# EAGLE design V-00757-01 (EAGLE 7.2.0)
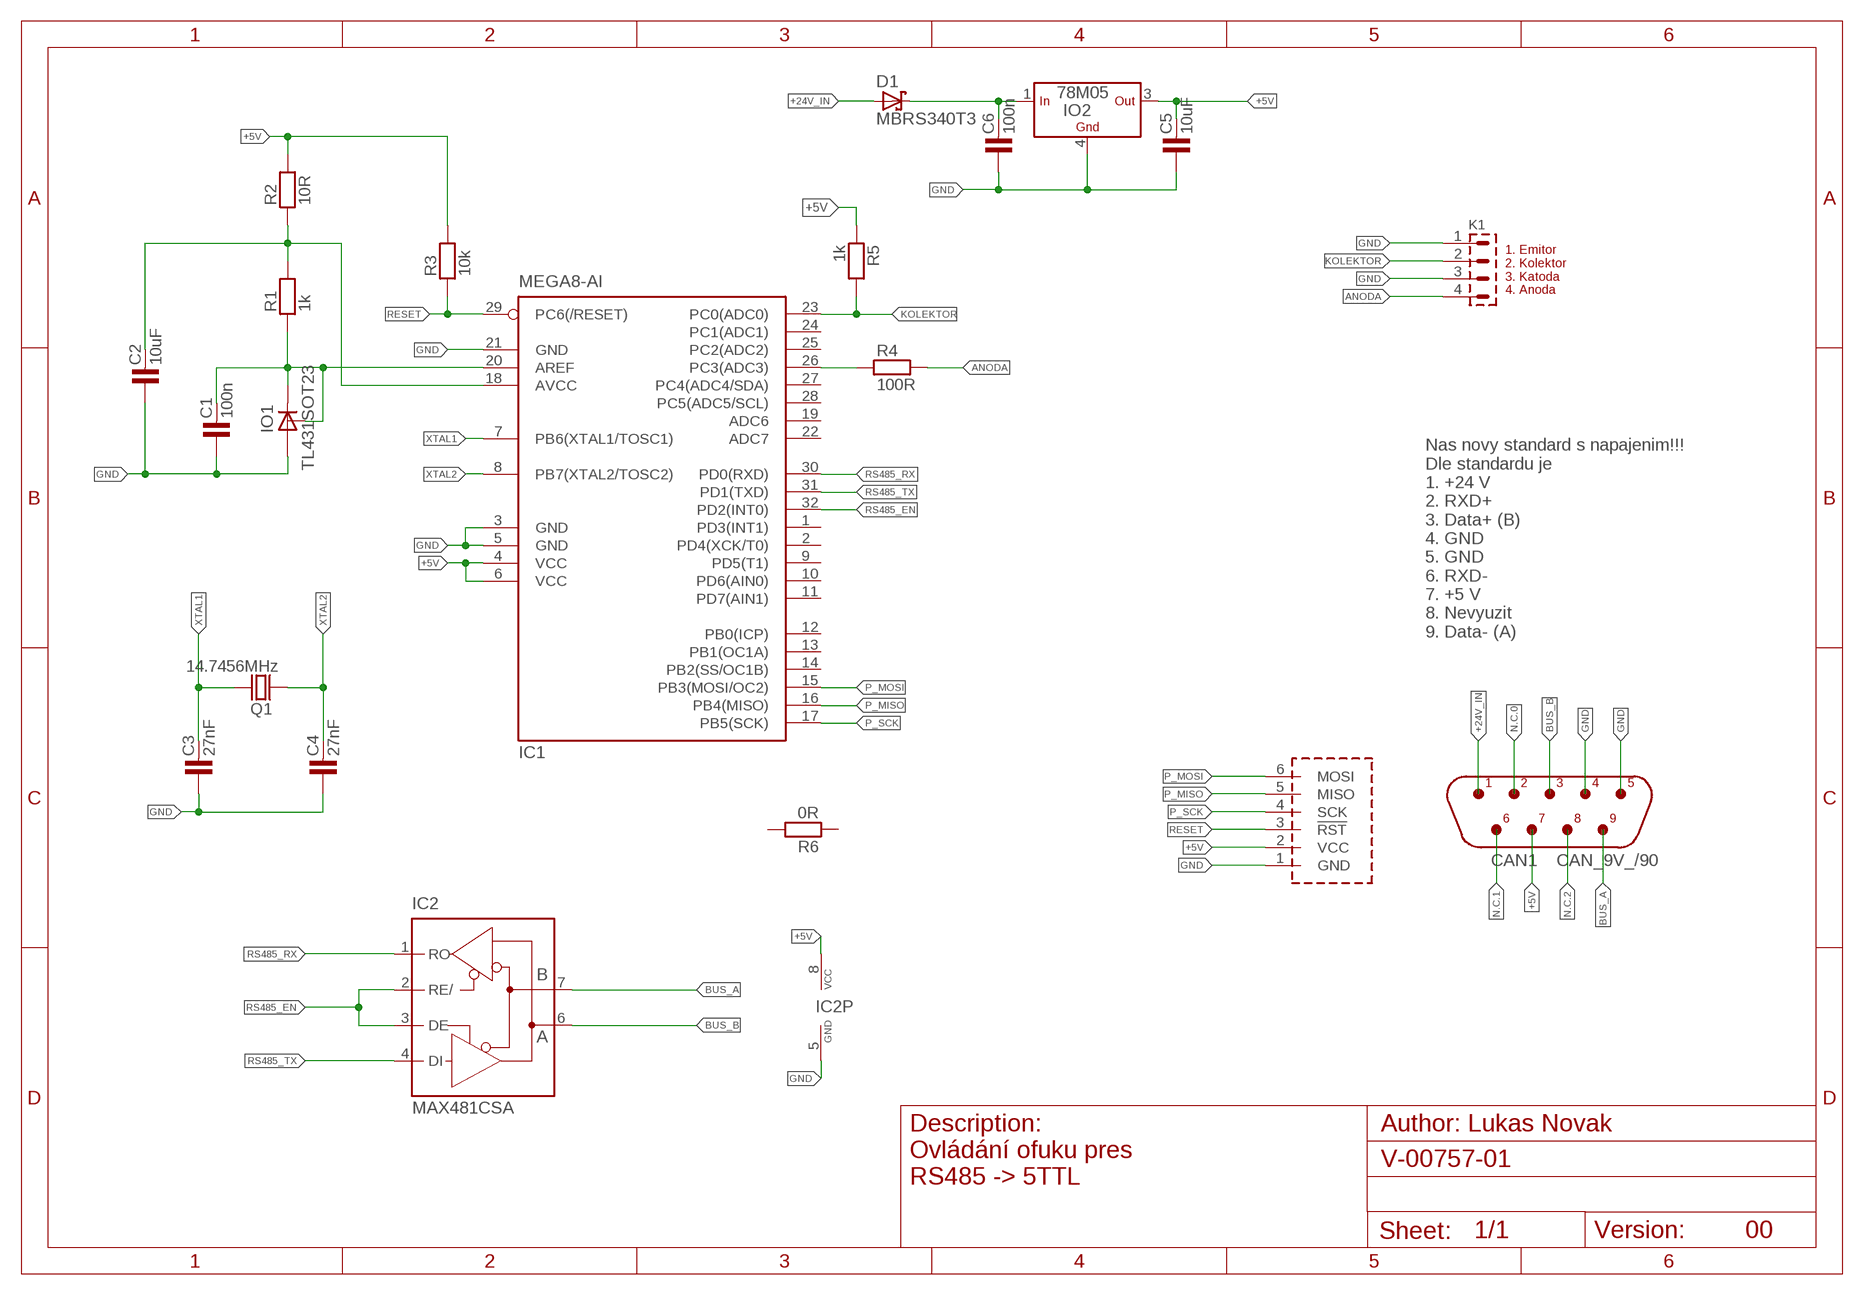
[diagram p0: schematic, sheet 1]

## Parts
C1  100n  C-KER_1206  [1206]
C2  10uF  C-KER_1206  [1206]
C3  27nF  C-KER_0805  [0805]
C4  27nF  C-KER_0805  [0805]
C5  10uF  C-KER_1206  [1206]
C6  100n  C-KER_1206  [1206]
CAN1  CAN_9V_/90  [CAN9V/90]
D1  MBRS340T3  [SMC]
IC1  MEGA8-AI  [TQFP32-08]
IC2  MAX481CSA  [SO08]
IO1  TL431SOT23  [SOT23]
IO2  78M05  78M  [DPAK]
K1  PSH02-04W  [PSH02-04W]
Q1  14.7456MHz  Q_HC-49U  [HC-49U]
R1  1k  R_1206  [1206]
R2  10R  R_1206  [1206]
R3  10k  R_1206  [1206]
R4  100R  R_1206  [1206]
R5  1k  R_1206  [1206]
R6  0R  R_1206  [1206]
U$1  AVR_PROG_SPI  [PSH02-06P]

## Nets
+5V: C5.2 CAN1.7 IC1.4(VCC) IC1.6(VCC) IC2.8(VCC) IO2.3(OUT) R2.2 R3.2 R5.1 U$1.2(VCC)
+24V: C6.2 D1.C IO2.1(IN)
+24V_IN: CAN1.1 D1.A
ANODA: K1.4 R4.2
BUS_A: CAN1.9 IC2.7(B)
BUS_B: CAN1.3 IC2.6(A)
GND: C1.1 C2.1 C3.1 C4.1 C5.1 C6.1 CAN1.4 CAN1.5 IC1.3(GND) IC1.5(GND) IC1.21(GND) IC2.5(GND) IO1.3(A) IO2.4(GND) K1.1 K1.3 U$1.1(GND)
KOLEKTOR: IC1.23(PC0(ADC0)) K1.2 R5.2
N$1: C1.2 IC1.20(AREF) IO1.1(C) IO1.2(R) R1.1
N$3: IC1.26(PC3(ADC3)) R4.1
N$6: C2.2 IC1.18(AVCC) R1.2 R2.1
N.C.0: CAN1.2
N.C.1: CAN1.6
N.C.2: CAN1.8
P_MISO: IC1.16(PB4(MISO)) U$1.5(MISO)
P_MOSI: IC1.15(PB3(MOSI/OC2)) U$1.6(MOSI)
P_SCK: IC1.17(PB5(SCK)) U$1.4(SCK)
RESET: IC1.29(PC6(/RESET)) R3.1 U$1.3(!RST)
RS485_EN: IC1.32(PD2(INT0)) IC2.2(RE/) IC2.3(DE)
RS485_RX: IC1.30(PD0(RXD)) IC2.1(RO)
RS485_TX: IC1.31(PD1(TXD)) IC2.4(DI)
XTAL1: C3.2 IC1.7(PB6(XTAL1/TOSC1)) Q1.2
XTAL2: C4.2 IC1.8(PB7(XTAL2/TOSC2)) Q1.1
Unconnected: IC1.1(PD3(INT1)) IC1.2(PD4(XCK/T0)) IC1.9(PD5(T1)) IC1.10(PD6(AIN0)) IC1.11(PD7(AIN1)) IC1.12(PB0(ICP)) IC1.13(PB1(OC1A)) IC1.14(PB2(SS/OC1B)) IC1.19(ADC6) IC1.22(ADC7) IC1.24(PC1(ADC1)) IC1.25(PC2(ADC2)) IC1.27(PC4(ADC4/SDA)) IC1.28(PC5(ADC5/SCL)) R6.1 R6.2

## Notes on the sheet
- 1. Emitor
  2. Kolektor
  3. Katoda
  4. Anoda
- Nas novy standard s napajenim!!!
  Dle standardu je
  1. +24 V
  2. RXD+
  3. Data+ (B)
  4. GND
  5. GND
  6. RXD-
  7. +5 V
  8. Nevyuzit
  9. Data- (A)
- Ovládání ofuku pres
  RS485 -> 5TTL
- 00

## Library data of the parts
C1-C6 = #PaJa_31:C-KER: Kondenzator - keramicky
CAN1 = #PaJa_konektory:CAN_9V: Konektory CANNON - vidlice - 9pinu
D1 = diode:MBRS3*0T3: SCHOTTKY BARRIER RECTIFIER 3.0 AMPERES 20, 30, 40 VOLT Source: MBRS340T3-D.pdf
IC1 = atmel:MEGA8: MICROCONTROLLER 8 Kbytes FLASH, 1 kbytes SRAM, 512 bytes EEPROM, USART, 6-channel 10 bit ADC, 2-channel 8 bit ADC Pin compatible with Atmega48, ATMega88, ATMega168 Source: avr.lbr; MPN: ATMEGA8-16AU; OC_FARNELL: 9171371; OC_NEWARK: 73M8863
IC2 = maxim:MAX481CSA: RS485 TRANSEIVER; MF: MAXIM; MPN: MAX481CSA; OC_FARNELL: unknown; OC_NEWARK: 90C3817
IO1 = references:TL431: Programmable Shunt Regulator TL431 Features > Programmable Output Voltage to 36 Volts > Low Dynamic Output Impedance 0.2? Typical > Sink Current Capability of 1.0 to 100mA > Equivalent Full-Range Temperature Coefficient of 50ppm/°C Typical > Temperature Compensated For Operation Over Full Rated Operating Temperature Range > Low Output Noise Voltage > Fast Turn-on Response; MPN: TL431BFDT; OC_FARNELL: 2095471; PACKAGE: SOT23; SUPPLIER: NXP
IO2 = #PaJa_31:78?: Stabilizator - 1A a 1,5A ? - napeti => 05, 06, 08, 09, 12, 15, 18, 20, 24 => 1,5A ? - napeti => 10, 12, 15, 18 => 1A S ? - napeti => 05, 09, 10, 12, 15, 18, 24 => 2A T ? - napeti => 05 => 3A ------------------------------------------------------- Stabilizator - 100mA (TO-92 , SOT-89) ? - napeti => 02, 05, 06, 08, 09, 12, 15, 18
K1 = #PaJa_konektory:PSH02-04: Konektory se zamkem - vidlice - 4pin
Q1 = #PaJa_31:Q: Krystal HC-49 - 1MHz - 48MHz DT38 - Quartz (hodinovy) 32,768kHz
R1-R6 = #PaJa_31:R: Rezistor
U$1 = #PaJa_konektory:AVR_PROG_SPI

## Board
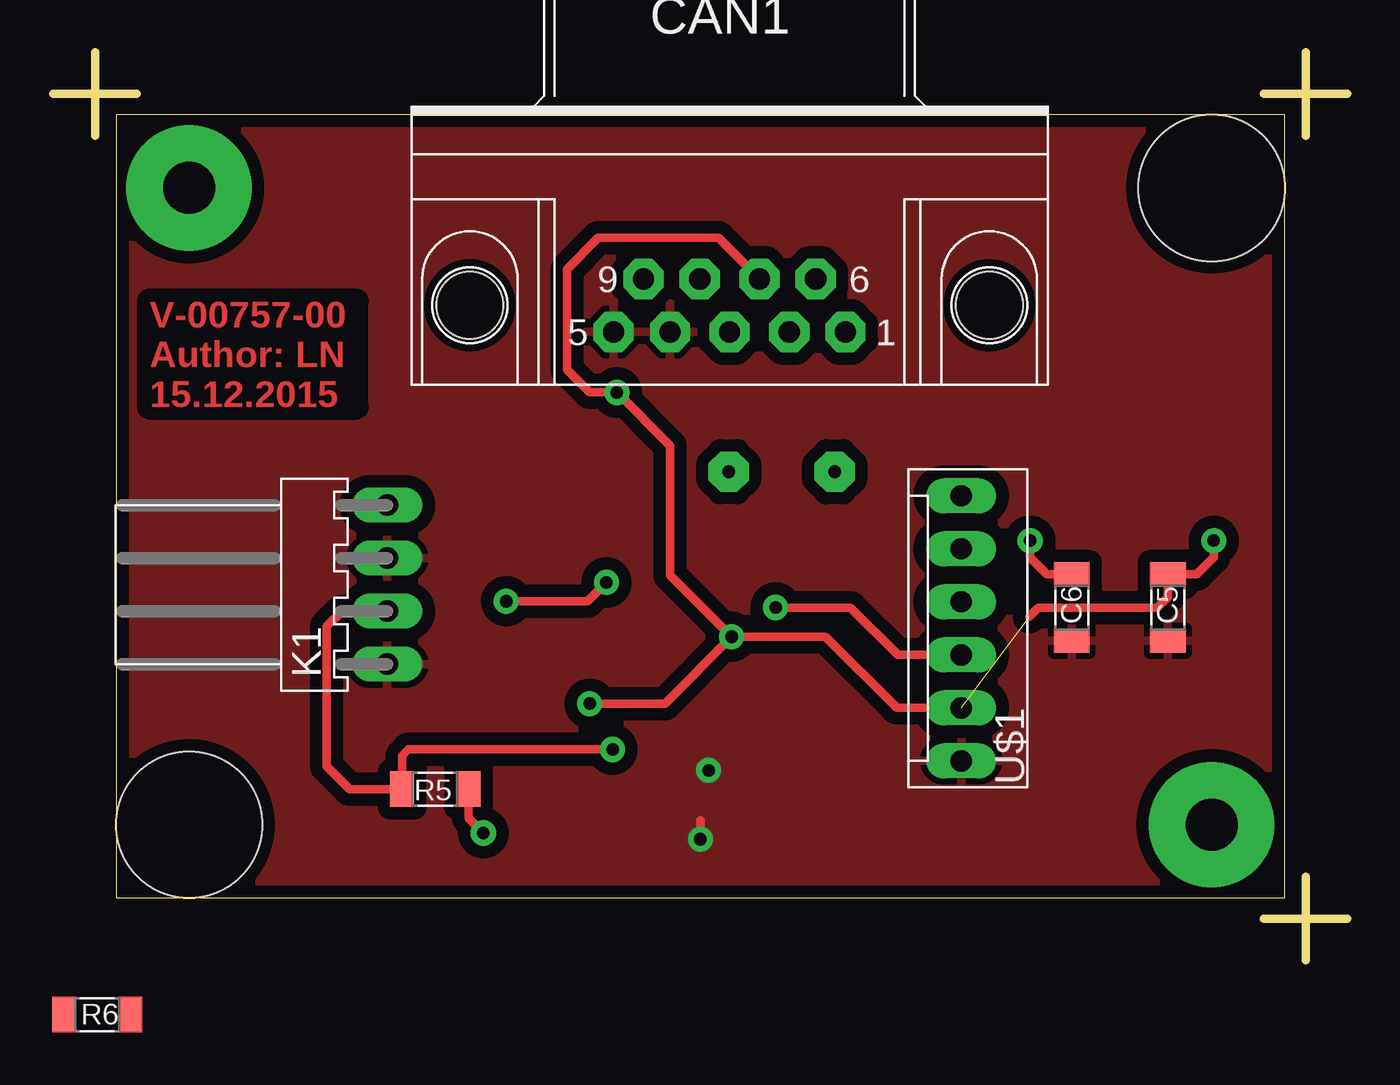
[diagram p1: board, top side]
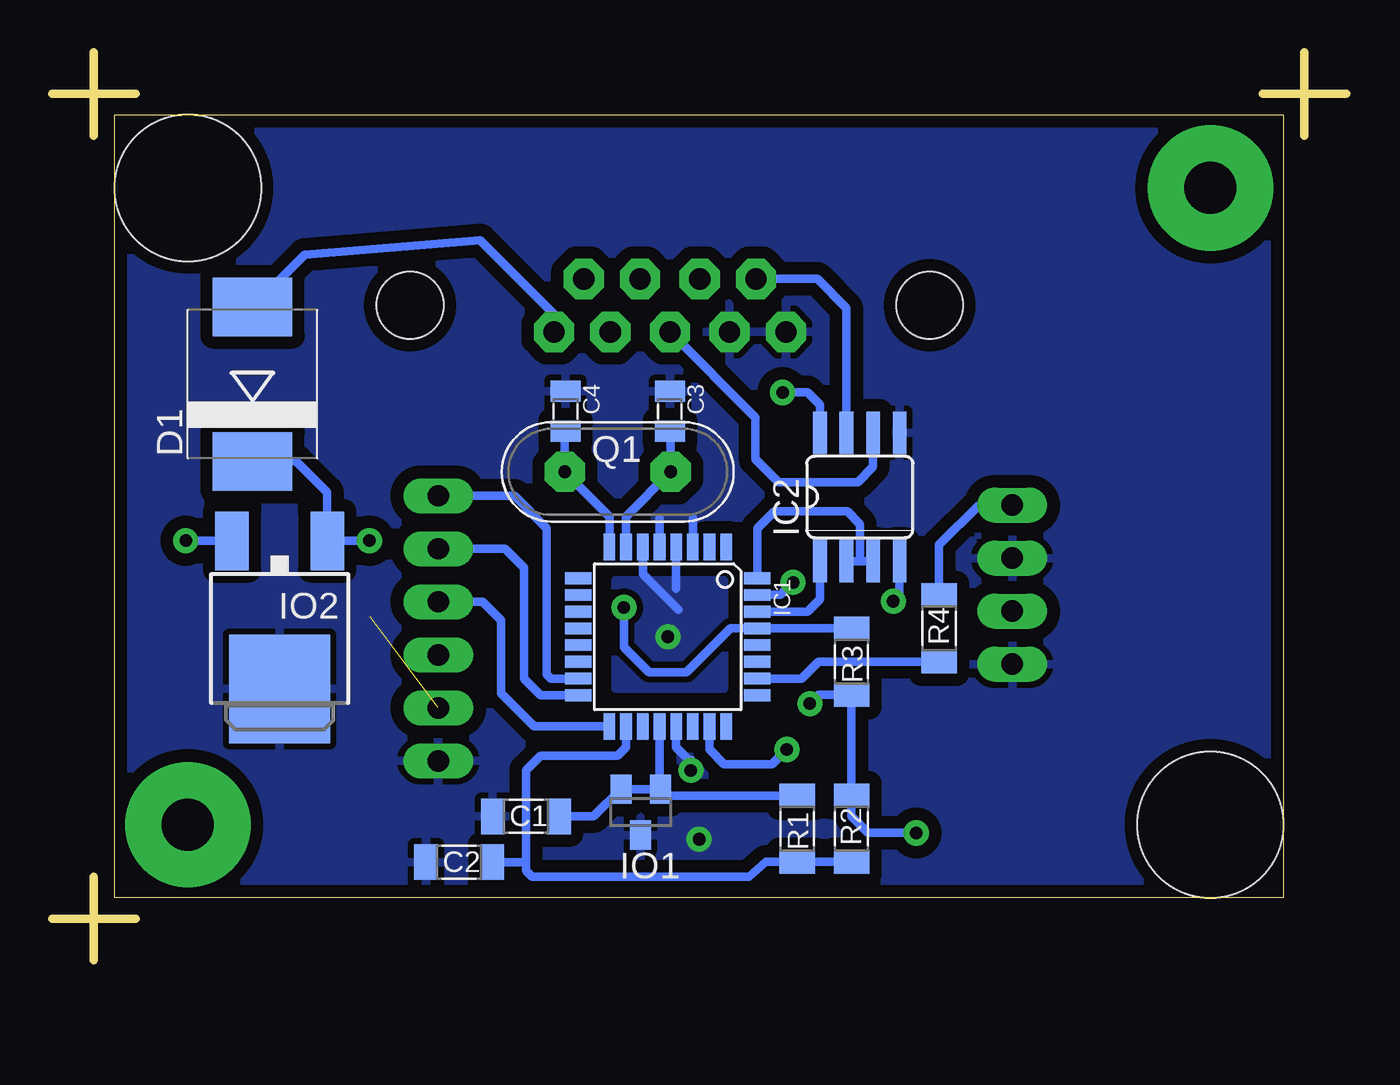
[diagram p2: board, bottom side, seen from below]

Size 62 x 43.5 mm. Coordinates in mm from the lower left corner, seen from the top.
Outline: 0,41.5 4,41.5
Outline: 2,39.5 2,43.5
Outline: 58,41.5 62,41.5
Outline: 60,39.5 60,43.5
Outline: 58,2 62,2
Outline: 60,0 60,4
Outline: 3,3 59,3 59,40.5 3,40.5 3,3
Copper layers (1*16): Top 0.04mm / dielectric 1.5mm / Bottom 0.04mm
Design rules "mucha_navrh *": minimum track width 0.2mm, minimum drill 0.6mm, track to track 0.3mm, track to pad 0.3mm, pad to pad 0.3mm, via to via 0.3mm, smd to smd 0mil, copper to edge 0.6mm, drill to drill 0.5mm, minimum pad ring 0.3mm, minimum via ring 0.3mm, stop-mask expansion 0.1mm, vias tented up to drill 0.8mm, thermal gap 0.3mm
Holes 7 mm at 6.5,6.5 55.5,37

### Footprints (pad centres in the part's own frame; a part is rotated, then mirrored left to right if it is on the bottom)
1206 = smd 1.143 x 1.702: 1 -1.587,0; 2 1.587,0
0805 = smd 1.016 x 1.422: 1 -0.953,0; 2 0.953,0
CAN9V/90 = drill 1.016 pad 1.93 octagon: 1 5.556,0; 2 2.857,0; 3 0,0; 4 -2.857,0; 5 -5.556,0; 6 4.128,2.54; 7 1.429,2.54; 8 -1.429,2.54; 9 -4.128,2.54 | hole 3.2: 12.446,1.27; -12.446,1.27
SMC = smd 2.8 x 3.8: A 3.7,0; C -3.7,0
TQFP32-08 = smd 1.27 x 0.559: 1 -4.293,2.8; 2 -4.293,2; 3 -4.293,1.2; 4 -4.293,0.4; 5 -4.293,-0.4; 6 -4.293,-1.2; 7 -4.293,-2; 8 -4.293,-2.8; 17 4.293,-2.8; 18 4.293,-2; 19 4.293,-1.2; 20 4.293,-0.4; 21 4.293,0.4; 22 4.293,1.2; 23 4.293,2; 24 4.293,2.8 | smd 0.559 x 1.27: 9 -2.8,-4.293; 10 -2,-4.293; 11 -1.2,-4.293; 12 -0.4,-4.293; 13 0.4,-4.293; 14 1.2,-4.293; 15 2,-4.293; 16 2.8,-4.293; 25 2.8,4.293; 26 2,4.293; 27 1.2,4.293; 28 0.4,4.293; 29 -0.4,4.293; 30 -1.2,4.293; 31 -2,4.293; 32 -2.8,4.293
SO08 = smd 0.66 x 2.032: 1 -1.905,-3.073; 2 -0.635,-3.073; 3 0.635,-3.073; 4 1.905,-3.073; 5 1.905,3.073; 6 0.635,3.073; 7 -0.635,3.073; 8 -1.905,3.073
SOT23 = smd 1 x 1.4: 1 -0.95,-1.1; 2 0.95,-1.1; 3 0,1.1
DPAK = smd 1.6 x 2.8: 1 -2.28,-4.992; 3 2.28,-4.992 | smd 4.826 x 5.191: 4 0,2.096
PSH02-04W = drill 1.016 pad 1.422 long: 1 -3.81,0; 2 -1.27,0; 3 1.27,0; 4 3.81,0
HC-49U = drill 0.61 pad 1.93 octagon: 1 -2.54,0; 2 2.54,0
PSH02-06P = drill 1.016 pad 1.422 long: 1 -6.35,0; 2 -3.81,0; 3 -1.27,0; 4 1.27,0; 5 3.81,0; 6 6.35,0

### Placement (x,y rotation side)
C1  39.3,6.9 0 bottom
C2  42.5,4.7 0 bottom
C3  32.4,26.3 270 bottom
C4  37.4,26.3 270 bottom
C5  53.4,16.9 90 top
C6  48.8,16.9 90 top
CAN1  32.4,30.1 0 top
D1  52.4,27.6 90 bottom
IC1  32.5,15.5 270 bottom
IC2  23.3,22.2 0 bottom
IO1  33.8,7.1 180 bottom
IO2  51.1,15.1 180 bottom
K1  16,18 90 top
Q1  34.9,23.4 0 bottom
R1  26.3,6.3 270 bottom
R2  23.7,6.3 90 bottom
R3  23.7,14.3 270 bottom
R4  19.5,15.9 90 bottom
R5  18.3,8.2 180 top
R6  2.1,-2.6 0 top
U$1  43.5,15.9 90 top

### Tracks (layer width: path | path; a pad name or v marks a point on that pad's centre or on a via)
+5V  (via drill 0.6)  (1 unrouted)
  Top 0.406: 46.77,16.47 47.2,16.9 52.9,16.9 53.4,17.4 C5.2 54.79,18.49 55.6,19.3 v55.6,20.1 | v32.5,15.5 29.54,18.46 29.54,24.66 v27,27.2 25.7,27.2 24.6,28.3 24.6,33.1 26.1,34.6 31.87,34.6 CAN1.7 | v25.7,12.3 29.3,12.3 v32.5,15.5 | v32.5,15.5 37,15.5 40.41,12.09 U$1.2 | R5.1 19.89,6.81 v20.6,6.1
  Bottom 0.406: IC1.4 32.1,17.8 | v25.7,12.3 25.29,12.71 R3.2 R2.2 23.7,6.9 22.9,6.1 v20.6,6.1 | IC1.6 33.7,18.5 32,16.8 | v55.6,20.1 IO2.3 | v27,27.2 25.8,27.2 25.2,26.61 IC2.8
  pour Bottom (rank 5): 29.8,18.2 35,18.2 35,13 29.8,13
+24V  (via drill 0.6)
  Top 0.406: C6.2 47.61,18.49 46.8,19.3 v46.8,20.1
  Bottom 0.406: D1.C 50.3,23.9 48.82,22.42 IO2.1 v46.8,20.1
+24V_IN
  Bottom 0.406: CAN1.1 37.96,30.96 41.5,34.5 49.9,33.8 D1.A
ANODA
  Bottom 0.406: K1.4 17.59,21.81 19.5,19.9 R4.2
BUS_A
  Bottom 0.406: IC2.7 23.93,31.23 25.34,32.64 CAN1.9
BUS_B
  Bottom 0.406: IC2.6 22.66,23.64 23.4,22.9 27.2,22.9 28.3,24 28.3,26 CAN1.3
GND  (via drill 0.6)
  Top 0.406: v31,5.8 31,6.7
  Bottom 0.406: IC1.3 31.3,21.2 | IC1.5 32.9,21.2 | IC1.21 32.1,10.2 31.5,9.6 31.4,9.6
  other vias: 31.4,9.1
  pour Bottom (isolate 0.6, rank 6): 3,3 59,3 59,40.5 3,40.5
  pour Top (isolate 0.6, rank 6): 3,3 59,3 59,40.5 3,40.5
KOLEKTOR  (via drill 0.6)
  Top 0.406: K1.2 13.83,16.73 13.1,16 13.1,9.3 14.2,8.2 R5.2 16.71,9.79 16.7,9.8 17,10.1 v26.8,10.1
  Bottom 0.406: IC1.23 30.5,10.1 29.8,9.4 27.5,9.4 v26.8,10.1
N$1
  Bottom 0.406: R1.1 32.54,7.89 IO1.1 | IC1.20 32.9,8.25 IO1.1 | IO1.1 IO1.2 36.05,6.9 C1.2
N$2  (via drill 2.5 pad 6)
  other vias: 6.5,37
N$3
  Bottom 0.406: R4.1 25.29,14.31 26.1,13.5 IC1.26
N$5  (via drill 2.5 pad 6)
  other vias: 55.5,6.5
N$6
  Bottom 0.406: R2.1 R1.2 27.79,4.71 28.6,4 39,4 39.3,4.3 39.3,4.6 | IC1.18 34.5,10.2 34.9,9.8 38.6,9.8 39.3,9.1 39.3,4.6 | C2.2 39.4,4.7 39.3,4.6
P_MISO
  Bottom 0.406: IC1.16 38.6,12.7 39.4,13.5 39.4,18.8 40.31,19.71 U$1.5
P_MOSI
  Bottom 0.406: IC1.15 38.1,13.5 38.3,13.7 38.3,20.7 39.85,22.25 U$1.6
P_SCK
  Bottom 0.406: IC1.17 38.91,11.21 40.5,12.8 40.5,16.3 41.37,17.17 U$1.4
RESET  (via drill 0.6)
  Top 0.406: U$1.3 40.47,14.63 38.2,16.9 v34.6,16.9
  Bottom 0.406: R3.1 23.81,15.9 IC1.29 29.5,15.9 31.6,13.8 33.4,13.8 34.6,15 v34.6,16.9
RS485_EN
  Bottom 0.406: IC1.32 28.21,20.69 27.4,21.5 23.9,21.5 23.3,20.9 23.3,19.13 | IC2.3 23.3,19.13 | 23.3,19.13 IC2.2
RS485_RX
  Bottom 0.406: IC1.30 25.8,16.7 25.2,17.3 IC2.1
RS485_TX  (via drill 0.6)
  Top 0.406: v21.7,17.2 25.6,17.2 v26.5,18.1
  Bottom 0.406: IC1.31 27.1,17.5 26.9,17.7 v26.5,18.1 | IC2.4 21.39,17.51 v21.7,17.2
XTAL1
  Bottom 0.406: IC1.7 34.5,21.26 Q1.2 32.36,25.31 C3.2
XTAL2
  Bottom 0.406: IC1.8 35.3,21.26 Q1.1 37.44,25.31 C4.2

### Text on the board
Top: V-00757-00 / Author: LN / 15.12.2015
Measures: 49.00 | 30.50